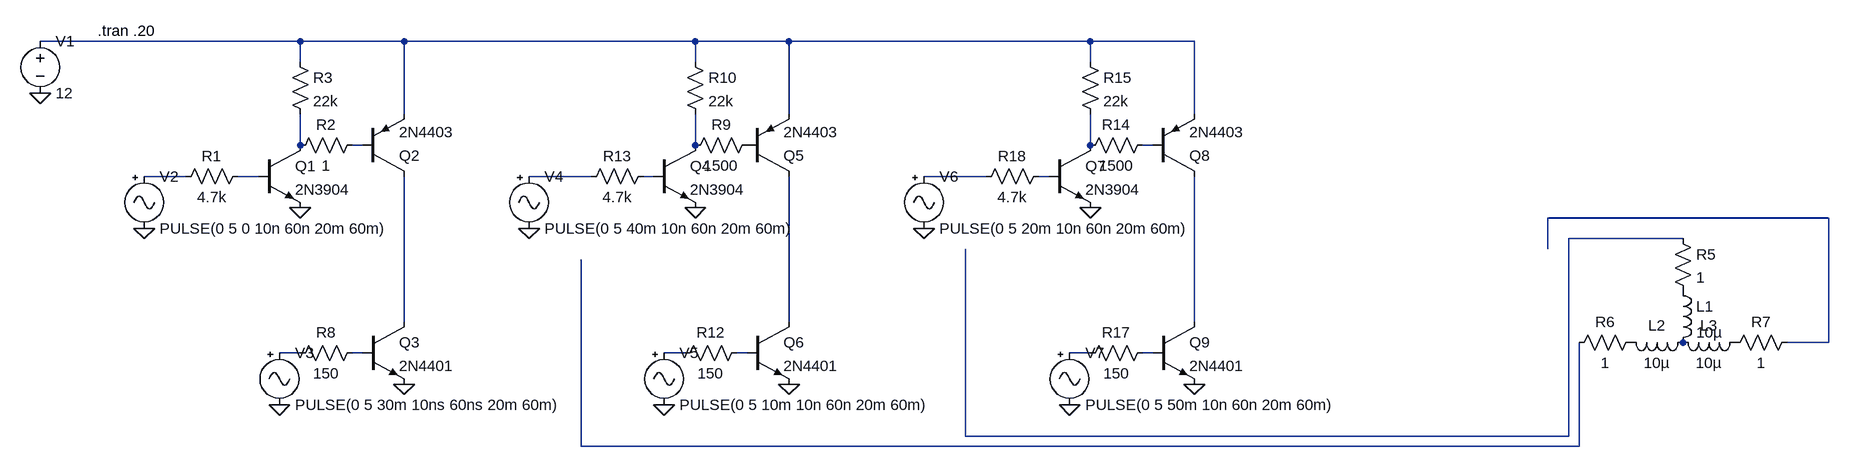
[diagram p0: schematic dc_motor_nte_261.asc]
dc_motor_nte_261.asc, the LTspice schematic file:
Version 4
SHEET 1 2740 776
WIRE 384 48 -16 48
WIRE 544 48 384 48
WIRE 992 48 544 48
WIRE 1136 48 992 48
WIRE 1600 48 1136 48
WIRE 1760 48 1600 48
WIRE 384 80 384 48
WIRE 992 80 992 48
WIRE 1600 80 1600 48
WIRE 544 160 544 48
WIRE 1136 160 1136 48
WIRE 1760 160 1760 48
WIRE 384 208 384 160
WIRE 480 208 464 208
WIRE 992 208 992 160
WIRE 1600 208 1600 160
WIRE 1696 208 1680 208
WIRE 208 256 144 256
WIRE 320 256 288 256
WIRE 832 256 736 256
WIRE 928 256 912 256
WIRE 1440 256 1344 256
WIRE 1536 256 1520 256
WIRE 2736 320 2304 320
WIRE 2512 352 2336 352
WIRE 2304 368 2304 320
WIRE 544 480 544 256
WIRE 1136 480 1136 256
WIRE 1760 480 1760 256
WIRE 2736 512 2736 320
WIRE 2736 512 2672 512
WIRE 384 528 352 528
WIRE 480 528 464 528
WIRE 976 528 944 528
WIRE 1072 528 1056 528
WIRE 1600 528 1568 528
WIRE 1696 528 1680 528
WIRE 1408 656 1408 368
WIRE 2336 656 2336 352
WIRE 2336 656 1408 656
WIRE 816 672 816 384
WIRE 2352 672 2352 512
WIRE 2352 672 816 672
FLAG -16 128 0
FLAG 384 304 0
FLAG 144 336 0
FLAG 544 576 0
FLAG 352 608 0
FLAG 992 304 0
FLAG 736 336 0
FLAG 1136 576 0
FLAG 944 608 0
FLAG 1600 304 0
FLAG 1344 336 0
FLAG 1760 576 0
FLAG 1568 608 0
SYMBOL voltage -16 32 R0
WINDOW 123 0 0 Left 2
WINDOW 39 0 0 Left 2
SYMATTR InstName V1
SYMATTR Value 12
SYMBOL npn 320 208 R0
SYMATTR InstName Q1
SYMATTR Value 2N3904
SYMBOL pnp 480 256 M180
SYMATTR InstName Q2
SYMATTR Value 2N4403
SYMBOL res 480 192 R90
WINDOW 0 0 56 VBottom 2
WINDOW 3 32 56 VTop 2
SYMATTR InstName R2
SYMATTR Value 1
SYMBOL res 368 64 R0
SYMATTR InstName R3
SYMATTR Value 22k
SYMBOL res 2496 336 R0
SYMATTR InstName R5
SYMATTR Value 1
SYMBOL res 2448 496 R90
WINDOW 0 0 56 VBottom 2
WINDOW 3 32 56 VTop 2
SYMATTR InstName R6
SYMATTR Value 1
SYMBOL res 2576 528 R270
WINDOW 0 32 56 VTop 2
WINDOW 3 0 56 VBottom 2
SYMATTR InstName R7
SYMATTR Value 1
SYMBOL Misc\\signal 144 240 R0
WINDOW 123 0 0 Left 2
WINDOW 39 0 0 Left 2
SYMATTR InstName V2
SYMATTR Value PULSE(0 5 0 10n 60n 20m 60m)
SYMBOL npn 480 480 R0
SYMATTR InstName Q3
SYMATTR Value 2N4401
SYMBOL Misc\\signal 352 512 R0
WINDOW 123 0 0 Left 2
WINDOW 39 0 0 Left 2
SYMATTR InstName V3
SYMATTR Value PULSE(0 5 30m 10ns 60ns 20m 60m)
SYMBOL res 480 512 R90
WINDOW 0 0 56 VBottom 2
WINDOW 3 32 56 VTop 2
SYMATTR InstName R8
SYMATTR Value 150
SYMBOL res 304 240 R90
WINDOW 0 0 56 VBottom 2
WINDOW 3 32 56 VTop 2
SYMATTR InstName R1
SYMATTR Value 4.7k
SYMBOL npn 928 208 R0
SYMATTR InstName Q4
SYMATTR Value 2N3904
SYMBOL pnp 1072 256 M180
SYMATTR InstName Q5
SYMATTR Value 2N4403
SYMBOL res 1088 192 R90
WINDOW 0 0 56 VBottom 2
WINDOW 3 32 56 VTop 2
SYMATTR InstName R9
SYMATTR Value 1500
SYMBOL res 976 64 R0
SYMATTR InstName R10
SYMATTR Value 22k
SYMBOL Misc\\signal 736 240 R0
WINDOW 123 0 0 Left 2
WINDOW 39 0 0 Left 2
SYMATTR InstName V4
SYMATTR Value PULSE(0 5 40m 10n 60n 20m 60m)
SYMBOL npn 1072 480 R0
SYMATTR InstName Q6
SYMATTR Value 2N4401
SYMBOL Misc\\signal 944 512 R0
WINDOW 123 0 0 Left 2
WINDOW 39 0 0 Left 2
SYMATTR InstName V5
SYMATTR Value PULSE(0 5 10m 10n 60n 20m 60m)
SYMBOL res 1072 512 R90
WINDOW 0 0 56 VBottom 2
WINDOW 3 32 56 VTop 2
SYMATTR InstName R12
SYMATTR Value 150
SYMBOL res 928 240 R90
WINDOW 0 0 56 VBottom 2
WINDOW 3 32 56 VTop 2
SYMATTR InstName R13
SYMATTR Value 4.7k
SYMBOL npn 1536 208 R0
SYMATTR InstName Q7
SYMATTR Value 2N3904
SYMBOL pnp 1696 256 M180
SYMATTR InstName Q8
SYMATTR Value 2N4403
SYMBOL res 1696 192 R90
WINDOW 0 0 56 VBottom 2
WINDOW 3 32 56 VTop 2
SYMATTR InstName R14
SYMATTR Value 1500
SYMBOL res 1584 64 R0
SYMATTR InstName R15
SYMATTR Value 22k
SYMBOL Misc\\signal 1344 240 R0
WINDOW 123 0 0 Left 2
WINDOW 39 0 0 Left 2
SYMATTR InstName V6
SYMATTR Value PULSE(0 5 20m 10n 60n 20m 60m)
SYMBOL npn 1696 480 R0
SYMATTR InstName Q9
SYMATTR Value 2N4401
SYMBOL Misc\\signal 1568 512 R0
WINDOW 123 0 0 Left 2
WINDOW 39 0 0 Left 2
SYMATTR InstName V7
SYMATTR Value PULSE(0 5 50m 10n 60n 20m 60m)
SYMBOL res 1696 512 R90
WINDOW 0 0 56 VBottom 2
WINDOW 3 32 56 VTop 2
SYMATTR InstName R17
SYMATTR Value 150
SYMBOL res 1536 240 R90
WINDOW 0 0 56 VBottom 2
WINDOW 3 32 56 VTop 2
SYMATTR InstName R18
SYMATTR Value 4.7k
SYMBOL ind 2496 416 R0
SYMATTR InstName L1
SYMATTR Value 10µ
SYMBOL ind 2528 496 R90
WINDOW 0 5 56 VBottom 2
WINDOW 3 32 56 VTop 2
SYMATTR InstName L2
SYMATTR Value 10µ
SYMBOL ind 2608 496 R90
WINDOW 0 5 56 VBottom 2
WINDOW 3 32 56 VTop 2
SYMATTR InstName L3
SYMATTR Value 10µ
TEXT 72 32 Left 2 !.tran .20

The netlist it stands for:
* dc_motor_nte_261.asc
V1 N001 0 12
Q1 N002 N008 0 0 2N3904
Q2 N015 N003 N001 0 2N4403
R2 N003 N002 1
R3 N001 N002 22k
R5 N014 P001 1
R6 P002 N024 1
R7 P003 N013 1
V2 N007 0 PULSE(0 5 0 10n 60n 20m 60m)
Q3 N015 N019 0 0 2N4401
V3 N018 0 PULSE(0 5 30m 10ns 60ns 20m 60m)
R8 N019 N018 150
R1 N008 N007 4.7k
Q4 N004 N010 0 0 2N3904
Q5 N016 P004 N001 0 2N4403
R9 P004 N004 1500
R10 N001 N004 22k
V4 N009 0 PULSE(0 5 40m 10n 60n 20m 60m)
Q6 N016 N021 0 0 2N4401
V5 N020 0 PULSE(0 5 10m 10n 60n 20m 60m)
R12 N021 N020 150
R13 N010 N009 4.7k
Q7 N005 N012 0 0 2N3904
Q8 N017 N006 N001 0 2N4403
R14 N006 N005 1500
R15 N001 N005 22k
V6 N011 0 PULSE(0 5 20m 10n 60n 20m 60m)
Q9 N017 N023 0 0 2N4401
V7 N022 0 PULSE(0 5 50m 10n 60n 20m 60m)
R17 N023 N022 150
R18 N012 N011 4.7k
L1 P001 P005 10µ
L2 P005 P002 10µ
L3 P003 P005 10µ
.model NPN NPN
.model PNP PNP
.lib standard.bjt
.tran .20
.backanno
.end